# Altium schematic sheet Sheet2.SchDoc
size A4
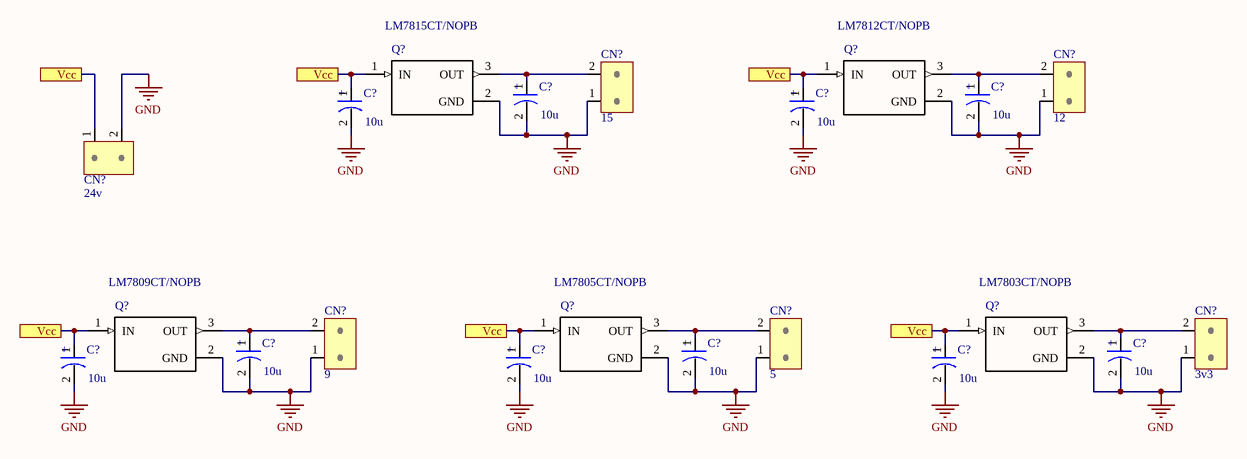
[diagram p0: Sheet2.SchDoc]

## Parts
(Parts that share a designator on the sheet are numbered #1, #2 ... from top to bottom, then left to right.)
C?#1  value 10u  [CAP_ALU_RADIAL_5MM]  (hidden comment: Electrolytic Capacitor)
C?#2  value 10u  [CAP_ALU_RADIAL_5MM]  (hidden comment: Electrolytic Capacitor)
C?#3  value 10u  [CAP_ALU_RADIAL_5MM]  (hidden comment: Electrolytic Capacitor)
C?#4  value 10u  [CAP_ALU_RADIAL_5MM]  (hidden comment: Electrolytic Capacitor)
C?#5  value 10u  [CAP_ALU_RADIAL_5MM]  (hidden comment: Electrolytic Capacitor)
C?#6  value 10u  [CAP_ALU_RADIAL_5MM]  (hidden comment: Electrolytic Capacitor)
C?#7  value 10u  [CAP_ALU_RADIAL_5MM]  (hidden comment: Electrolytic Capacitor)
C?#8  value 10u  [CAP_ALU_RADIAL_5MM]  (hidden comment: Electrolytic Capacitor)
C?#9  value 10u  [CAP_ALU_RADIAL_5MM]  (hidden comment: Electrolytic Capacitor)
C?#10  value 10u  [CAP_ALU_RADIAL_5MM]  (hidden comment: Electrolytic Capacitor)
CN?#1  15  [CN_KRE_2]
CN?#2  12  [CN_KRE_2]
CN?#3  24v  [CN_KRE_2]
CN?#4  9  [CN_KRE_2]
CN?#5  5  [CN_KRE_2]
CN?#6  3v3  [CN_KRE_2]
Q?#1  LM7815CT/NOPB  [*TO254P1054X470X2600-3]
Q?#2  LM7812CT/NOPB  [*TO254P1054X470X2600-3]
Q?#3  LM7809CT/NOPB  [*TO254P1054X470X2600-3]
Q?#4  LM7805CT/NOPB  [*TO254P1054X470X2600-3]
Q?#5  LM7803CT/NOPB  [*TO254P1054X470X2600-3]

## Ports
Vcc

## Nets
GND: C?#1.2 C?#2.2 C?#3.2 C?#4.2 C?#5.2 C?#6.2 C?#7.2 C?#8.2 C?#9.2 C?#10.2 CN?#1.1 CN?#2.1 CN?#3.2 CN?#4.1 CN?#5.1 CN?#6.1 Q?#1.2(GND) Q?#2.2(GND) Q?#3.2(GND) Q?#4.2(GND) Q?#5.2(GND)
Vcc: C?#3.1 C?#4.1 C?#8.1 C?#9.1 C?#10.1 CN?#3.1 Q?#1.1(IN) Q?#2.1(IN) Q?#3.1(IN) Q?#4.1(IN) Q?#5.1(IN) ; port Vcc
NetC?#1_1: C?#1.1 CN?#1.2 Q?#1.3(OUT)
NetC?#2_1: C?#2.1 CN?#2.2 Q?#2.3(OUT)
NetC?#5_1: C?#5.1 CN?#4.2 Q?#3.3(OUT)
NetC?#6_1: C?#6.1 CN?#5.2 Q?#4.3(OUT)
NetC?#7_1: C?#7.1 CN?#6.2 Q?#5.3(OUT)

## Notes on the sheet
- (in symbol CAP_ALU_RADIAL_5MM) +

## Library data of the parts
C?#1-C?#10 = CAP_ALU_RADIAL_5MM: PTH Radial Electrolytic Capacitor; Tensão: ?
CN?#1-CN?#6 = CN_MKDS_2: MKDS_2; Value: ?
Q?#1-Q?#5 = LM7805CT/NOPB: Linear Voltage Regulator IC Positive Fixed 1 Output 1A TO-220-3; MF: ON Semiconductor; Package: TO-220 ON Semiconductor; MP: LM7805CT; SnapEDA_Link: https://www.snapeda.com/parts/LM7805CT/ON%20Semiconductor/view-part/546231/?ref=snap; Availability: Unavailable; Price: None; Value: *